# EAGLE schematic ledCube (EAGLE 8.5.0)
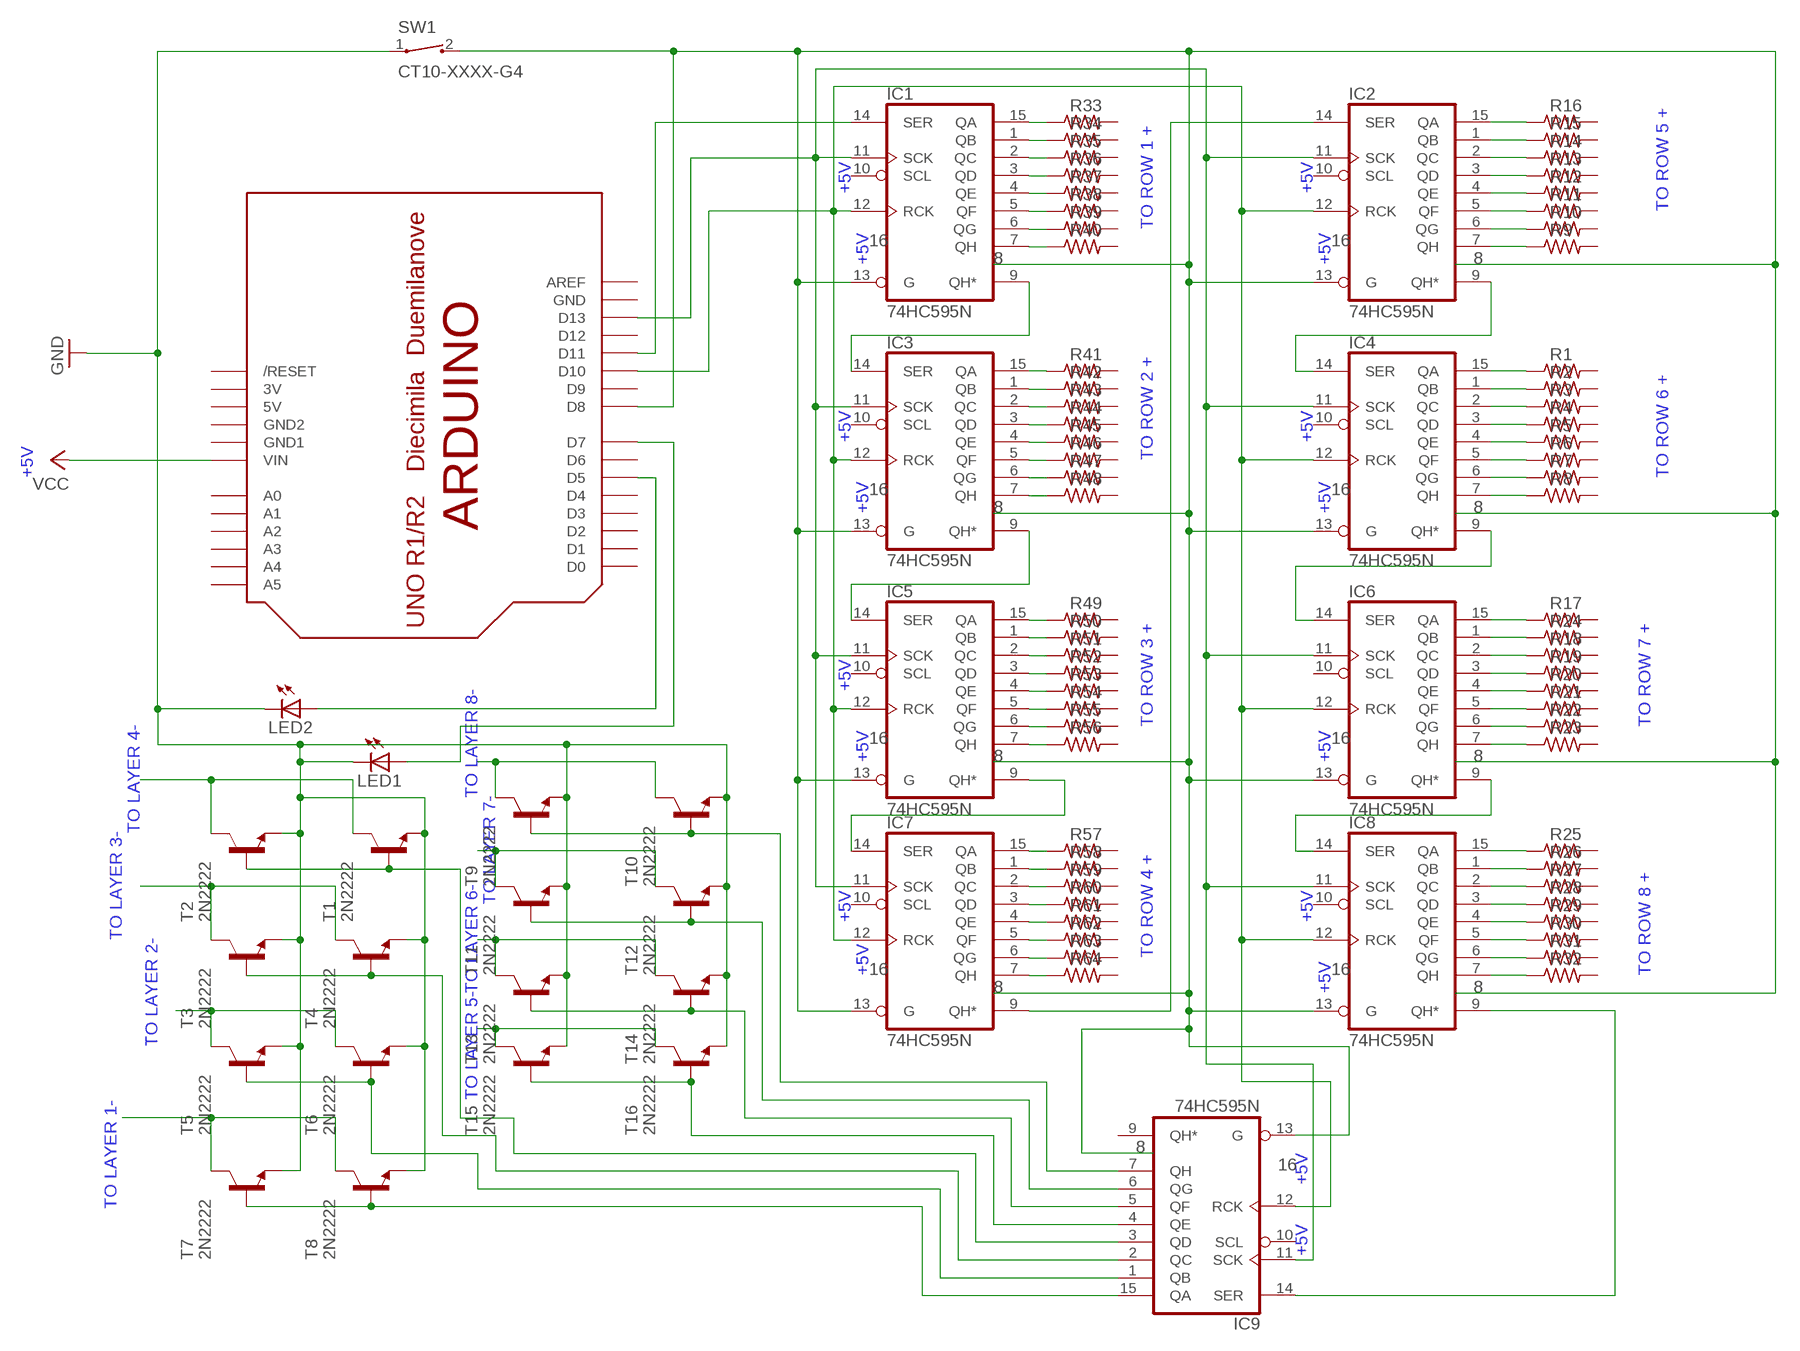
[diagram p0: schematic, sheet 1]

## Parts
IC1  74HC595N  [DIL16]
IC2  74HC595N  [DIL16]
IC3  74HC595N  [DIL16]
IC4  74HC595N  [DIL16]
IC5  74HC595N  [DIL16]
IC6  74HC595N  [DIL16]
IC7  74HC595N  [DIL16]
IC8  74HC595N  [DIL16]
IC9  74HC595N  [DIL16]
LED1  LED  [SMARTLED-TTW]
LED2  LED  [SMARTLED-TTW]
R1  RES-0207/10  [0207/10]
R2  RES-0207/10  [0207/10]
R3  RES-0207/10  [0207/10]
R4  RES-0207/10  [0207/10]
R5  RES-0207/10  [0207/10]
R6  RES-0207/10  [0207/10]
R7  RES-0207/10  [0207/10]
R8  RES-0207/10  [0207/10]
R9  RES-0207/10  [0207/10]
R10  RES-0207/10  [0207/10]
R11  RES-0207/10  [0207/10]
R12  RES-0207/10  [0207/10]
R13  RES-0207/10  [0207/10]
R14  RES-0207/10  [0207/10]
R15  RES-0207/10  [0207/10]
R16  RES-0207/10  [0207/10]
R17  RES-0207/10  [0207/10]
R18  RES-0207/10  [0207/10]
R19  RES-0207/10  [0207/10]
R20  RES-0207/10  [0207/10]
R21  RES-0207/10  [0207/10]
R22  RES-0207/10  [0207/10]
R23  RES-0207/10  [0207/10]
R24  RES-0207/10  [0207/10]
R25  RES-0207/10  [0207/10]
R26  RES-0207/10  [0207/10]
R27  RES-0207/10  [0207/10]
R28  RES-0207/10  [0207/10]
R29  RES-0207/10  [0207/10]
R30  RES-0207/10  [0207/10]
R31  RES-0207/10  [0207/10]
R32  RES-0207/10  [0207/10]
R33  RES-0207/10  [0207/10]
R34  RES-0207/10  [0207/10]
R35  RES-0207/10  [0207/10]
R36  RES-0207/10  [0207/10]
R37  RES-0207/10  [0207/10]
R38  RES-0207/10  [0207/10]
R39  RES-0207/10  [0207/10]
R40  RES-0207/10  [0207/10]
R41  RES-0207/10  [0207/10]
R42  RES-0207/10  [0207/10]
R43  RES-0207/10  [0207/10]
R44  RES-0207/10  [0207/10]
R45  RES-0207/10  [0207/10]
R46  RES-0207/10  [0207/10]
R47  RES-0207/10  [0207/10]
R48  RES-0207/10  [0207/10]
R49  RES-0207/10  [0207/10]
R50  RES-0207/10  [0207/10]
R51  RES-0207/10  [0207/10]
R52  RES-0207/10  [0207/10]
R53  RES-0207/10  [0207/10]
R54  RES-0207/10  [0207/10]
R55  RES-0207/10  [0207/10]
R56  RES-0207/10  [0207/10]
R57  RES-0207/10  [0207/10]
R58  RES-0207/10  [0207/10]
R59  RES-0207/10  [0207/10]
R60  RES-0207/10  [0207/10]
R61  RES-0207/10  [0207/10]
R62  RES-0207/10  [0207/10]
R63  RES-0207/10  [0207/10]
R64  RES-0207/10  [0207/10]
SW1  CT10-XXXX-G4  [CT10-XXXX-G4]
T1  2N2222  [TO92-EBC-OVAL]
T2  2N2222  [TO92-EBC-OVAL]
T3  2N2222  [TO92-EBC-OVAL]
T4  2N2222  [TO92-EBC-OVAL]
T5  2N2222  [TO92-EBC-OVAL]
T6  2N2222  [TO92-EBC-OVAL]
T7  2N2222  [TO92-EBC-OVAL]
T8  2N2222  [TO92-EBC-OVAL]
T9  2N2222  [TO92-EBC-OVAL]
T10  2N2222  [TO92-EBC-OVAL]
T11  2N2222  [TO92-EBC-OVAL]
T12  2N2222  [TO92-EBC-OVAL]
T13  2N2222  [TO92-EBC-OVAL]
T14  2N2222  [TO92-EBC-OVAL]
T15  2N2222  [TO92-EBC-OVAL]
T16  2N2222  [TO92-EBC-OVAL]
U$1  ARDUINO-BPLACE  [ARDUINO-BPLACE]

## Nets
GND: LED1.C@1(C) LED2.C@1(C) SW1.1 T1.E T2.E T3.E T4.E T5.E T6.E T7.E T8.E T9.E T10.E T11.E T12.E T13.E T14.E T15.E T16.E
N$1: IC1.11(SCK) IC2.11(SCK) IC3.11(SCK) IC4.11(SCK) IC5.11(SCK) IC6.11(SCK) IC7.11(SCK) IC8.11(SCK) IC9.11(SCK) U$1.D13
N$2: IC1.14(SER) U$1.D11
N$3: IC1.9(QH*) IC3.14(SER)
N$4: IC1.13(G) IC2.13(G) IC3.13(G) IC4.13(G) IC5.13(G) IC6.13(G) IC7.13(G) IC8.13(G) IC9.13(G) SW1.2 U$1.D8
N$5: LED1.A@1(A) U$1.D7
N$6: LED2.A@1(A) U$1.D5
N$7: IC9.15(QA) T7.B T8.B
N$8: IC3.15(QA) R41.1
N$9: IC9.1(QB) T5.B T6.B
N$10: IC9.2(QC) T3.B T4.B
N$11: IC9.3(QD) T1.B T2.B
N$12: IC9.4(QE) T15.B T16.B
N$13: IC9.5(QF) T13.B T14.B
N$14: IC9.6(QG) T11.B T12.B
N$15: IC9.7(QH) T9.B T10.B
N$16: T1.C T2.C
N$17: T3.C T4.C
N$18: T5.C T6.C
N$19: T7.C T8.C
N$20: T9.C T10.C
N$21: T11.C T12.C
N$22: T13.C T14.C
N$23: T15.C T16.C
N$24: IC8.9(QH*) IC9.14(SER)
N$25: IC1.12(RCK) IC2.12(RCK) IC3.12(RCK) IC4.12(RCK) IC5.12(RCK) IC6.12(RCK) IC7.12(RCK) IC8.12(RCK) IC9.12(RCK) U$1.D10
N$26: IC3.9(QH*) IC5.14(SER)
N$27: IC5.9(QH*) IC7.14(SER)
N$28: IC2.14(SER) IC7.9(QH*)
N$29: IC2.9(QH*) IC4.14(SER)
N$30: IC4.9(QH*) IC6.14(SER)
N$31: IC6.9(QH*) IC8.14(SER)
N$32: IC4.15(QA) R1.1
N$33: IC4.1(QB) R2.1
N$34: IC4.2(QC) R3.1
N$35: IC4.3(QD) R4.1
N$36: IC4.4(QE) R5.1
N$37: IC4.5(QF) R6.1
N$38: IC4.6(QG) R7.1
N$39: IC4.7(QH) R8.1
N$40: IC2.7(QH) R9.1
N$41: IC2.6(QG) R10.1
N$42: IC2.5(QF) R11.1
N$43: IC2.4(QE) R12.1
N$44: IC2.3(QD) R13.1
N$45: IC2.2(QC) R14.1
N$46: IC2.1(QB) R15.1
N$47: IC2.15(QA) R16.1
N$48: IC6.15(QA) R17.1
N$49: IC6.2(QC) R18.1
N$50: IC6.3(QD) R19.1
N$51: IC6.4(QE) R20.1
N$52: IC6.5(QF) R21.1
N$53: IC6.6(QG) R22.1
N$54: IC6.7(QH) R23.1
N$55: IC6.1(QB) R24.1
N$56: IC8.15(QA) R25.1
N$57: IC8.1(QB) R26.1
N$58: IC8.2(QC) R27.1
N$59: IC8.3(QD) R28.1
N$60: IC8.4(QE) R29.1
N$61: IC8.5(QF) R30.1
N$62: IC8.6(QG) R31.1
N$63: IC8.7(QH) R32.1
N$64: IC7.7(QH) R64.1
N$65: IC7.6(QG) R63.1
N$66: IC7.5(QF) R62.1
N$67: IC7.4(QE) R61.1
N$68: IC7.3(QD) R60.1
N$69: IC7.2(QC) R59.1
N$70: IC7.1(QB) R58.1
N$71: IC7.15(QA) R57.1
N$72: IC5.7(QH) R56.1
N$73: IC5.6(QG) R55.1
N$74: IC5.5(QF) R54.1
N$75: IC5.4(QE) R53.1
N$76: IC5.3(QD) R52.1
N$77: IC5.2(QC) R51.1
N$78: IC5.1(QB) R50.1
N$79: IC5.15(QA) R49.1
N$80: IC3.7(QH) R48.1
N$81: IC3.6(QG) R47.1
N$82: IC3.5(QF) R46.1
N$83: IC3.4(QE) R45.1
N$84: IC3.3(QD) R44.1
N$85: IC3.2(QC) R43.1
N$86: IC3.1(QB) R42.1
N$87: IC1.7(QH) R40.1
N$88: IC1.6(QG) R39.1
N$89: IC1.5(QF) R38.1
N$90: IC1.4(QE) R37.1
N$91: IC1.3(QD) R36.1
N$92: IC1.2(QC) R35.1
N$93: IC1.1(QB) R34.1
N$94: IC1.15(QA) R33.1
VCC: U$1.VIN
Unconnected: IC1.10(SCL) IC2.10(SCL) IC3.10(SCL) IC4.10(SCL) IC5.10(SCL) IC6.10(SCL) IC7.10(SCL) IC8.10(SCL) IC9.9(QH*) IC9.10(SCL) R1.2 R2.2 R3.2 R4.2 R5.2 R6.2 R7.2 R8.2 R9.2 R10.2 R11.2 R12.2 R13.2 R14.2 R15.2 R16.2 R17.2 R18.2 R19.2 R20.2 R21.2 R22.2 R23.2 R24.2 R25.2 R26.2 R27.2 R28.2 R29.2 R30.2 R31.2 R32.2 R33.2 R34.2 R35.2 R36.2 R37.2 R38.2 R39.2 R40.2 R41.2 R42.2 R43.2 R44.2 R45.2 R46.2 R47.2 R48.2 R49.2 R50.2 R51.2 R52.2 R53.2 R54.2 R55.2 R56.2 R57.2 R58.2 R59.2 R60.2 R61.2 R62.2 R63.2 R64.2 U$1.A0 U$1.A1 U$1.A2 U$1.A3 U$1.A4 U$1.A5 U$1.AREF U$1.D0 U$1.D1 U$1.D2 U$1.D3 U$1.D4 U$1.D6 U$1.D9 U$1.D12 U$1.RESET(/RESET)

## Notes on the sheet
- +5V | +5V
- TO ROW 5 +
- TO ROW 1 +
- 16 | 16
- +5V | 8 | +5V | 8
- +5V | +5V
- TO ROW 2 +
- +5V | TO ROW 6 +
- 16 | 16
- +5V | 8 | +5V | 8
- +5V
- TO ROW 3 + | TO ROW 7 +
- 16 | 16
- +5V | 8 | +5V | 8
- TO LAYER 8-
- TO LAYER 4-
- TO LAYER 7-
- +5V | +5V
- TO LAYER 3-
- TO ROW 4 +
- +5V | 16 | 16 | TO ROW 8 +
- TO LAYER 6- | 8 | +5V | 8
- TO LAYER 2-
- TO LAYER 1- | TO LAYER 5-
- 8 | +5V
- 16
- +5V

## Power pins joined to a net without a drawn wire
3V: U$1.3V
5V: U$1.5V
GND: IC1.8(GND) IC2.8(GND) IC3.8(GND) IC4.8(GND) IC5.8(GND) IC6.8(GND) IC7.8(GND) IC8.8(GND) IC9.8(GND) U$1.GND
GND1: U$1.GND1
GND2: U$1.GND2
VCC: IC1.16(VCC) IC2.16(VCC) IC3.16(VCC) IC4.16(VCC) IC5.16(VCC) IC6.16(VCC) IC7.16(VCC) IC8.16(VCC) IC9.16(VCC)

## Library data of the parts
IC1-IC9 = 74xx-eu:74*595: 8-bit SHIFT REGISTER, output latch
LED1 LED2 = adafruit:LED: LED OSRAM: - CHIPLED LG R971, LG N971, LY N971, LG Q971, LY Q971, LO R971, LY R971 LH N974, LH R974 LS Q976, LO Q976, LY Q976 LO Q996 - Hyper CHIPLED LW Q18S LB Q993, LB Q99A, LB R99A - SideLED LS A670, LO A670, LY A670, LG A670, LP A670 LB A673, LV A673, LT A673, LW A673 LH A674 LY A675 LS A676, LA A676, LO A676, LY A676, LW A676 LS A679, LY A679, LG A679 - Hyper Micro SIDELED® LS Y876, LA Y876, LO Y876, LY Y876 LT Y87S - SmartLED LW L88C, LW L88S LB L89C, LB L89S, LG L890 LS L89K, LO L89K, LY L89K LS L896, LA L896, LO L896, LY L896 - TOPLED LS T670, LO T670, LY T670, LG T670, LP T670 LSG T670, LSP T670, LSY T670, LOP T670, LYG T670 LG T671, LOG T671, LSG T671 LB T673, LV T673, LT T673, LW T673 LH T674 LS T676, LA T676, LO T676, LY T676, LB T676, LH T676, LSB T676, LW T676 LB T67C, LV T67C, LT T67C, LS T67K, LO T67K, LY T67K, LW E67C LS E67B, LA E67B, LO E67B, LY E67B, LB E67C, LV E67C, LT E67C LW T67C LS T679, LY T679, LG T679 LS T770, LO T770, LY T770, LG T770, LP T770 LB T773, LV T773, LT T773, LW T773 LH T774 LS E675, LA E675, LY E675, LS T675 LS T776, LA T776, LO T776, LY T776, LB T776 LHGB T686 LT T68C, LB T68C - Hyper Mini TOPLED® LB M676 - Mini TOPLED Santana® LG M470 LS M47K, LO M47K, LY M47K Source: http://www.osram.convergy.de/
R1-R64 = prox_sens_LED:RES: Resistor
SW1 = switch-coto:CT10-XXXX-: CT10 Series Molded Switch Source: www.cotorelay.com .. Coto_Technology__CT10-1530-G1.pdf
T1-T16 = adafruit:2N2222: NPN TRANSISTOR Big oval pads
U$1 = adafruit:ARDUINO: Arduino Diecimila/Duemilanove Make a shield with ease, this package has all the named pins as well as the two mounting drill holes and an outline of the USB and DC power connector. The outline is on the DIMENSION layer, so if your board house uses it they will cut the outline to match. http://www.ladyada.net/library/pcb/eaglelibrary.html